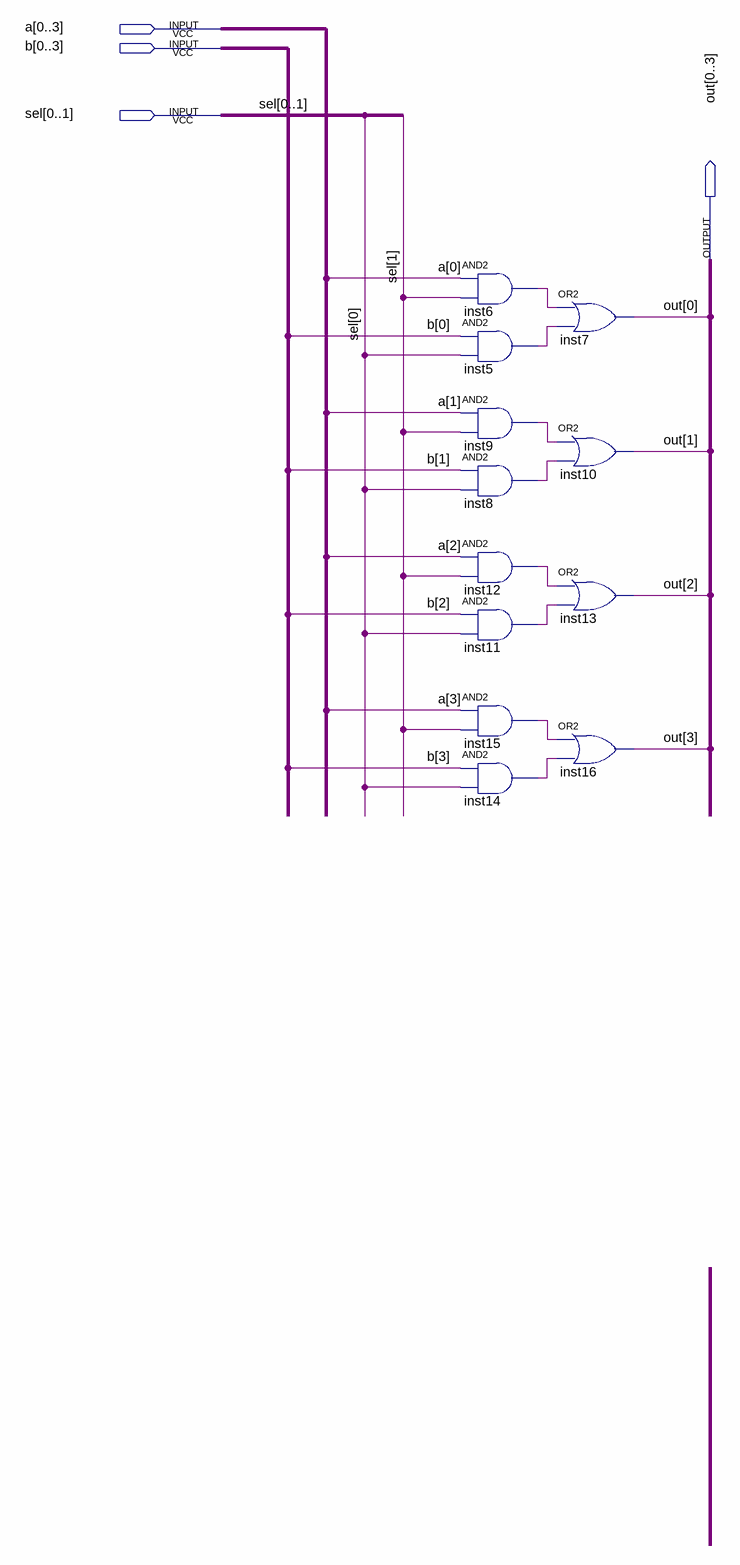
[diagram p0: schematic sheet]
// Quartus schematic 2bit_2sel_mux4.bdf as structural Verilog: 12 symbols, 4 pins
module \2bit_2sel_mux4  (
  input  [0:3] a,
  input  [0:3] b,
  input  [0:1] sel,
  output [0:3] out
);

  wire inst5_out, inst6_out, inst8_out, inst9_out, inst11_out, inst12_out, inst14_out, inst15_out;

  and inst6 (inst6_out, a[0], sel[1]);
  and inst5 (inst5_out, b[0], sel[0]);
  and inst9 (inst9_out, a[1], sel[1]);
  and inst8 (inst8_out, b[1], sel[0]);
  and inst12 (inst12_out, a[2], sel[1]);
  and inst11 (inst11_out, b[2], sel[0]);
  and inst15 (inst15_out, a[3], sel[1]);
  and inst14 (inst14_out, b[3], sel[0]);
  or inst7 (out[0], inst6_out, inst5_out);
  or inst10 (out[1], inst9_out, inst8_out);
  or inst13 (out[2], inst12_out, inst11_out);
  or inst16 (out[3], inst15_out, inst14_out);
endmodule
